# EAGLE design LNA_TL_choke (EAGLE 6.5.0)
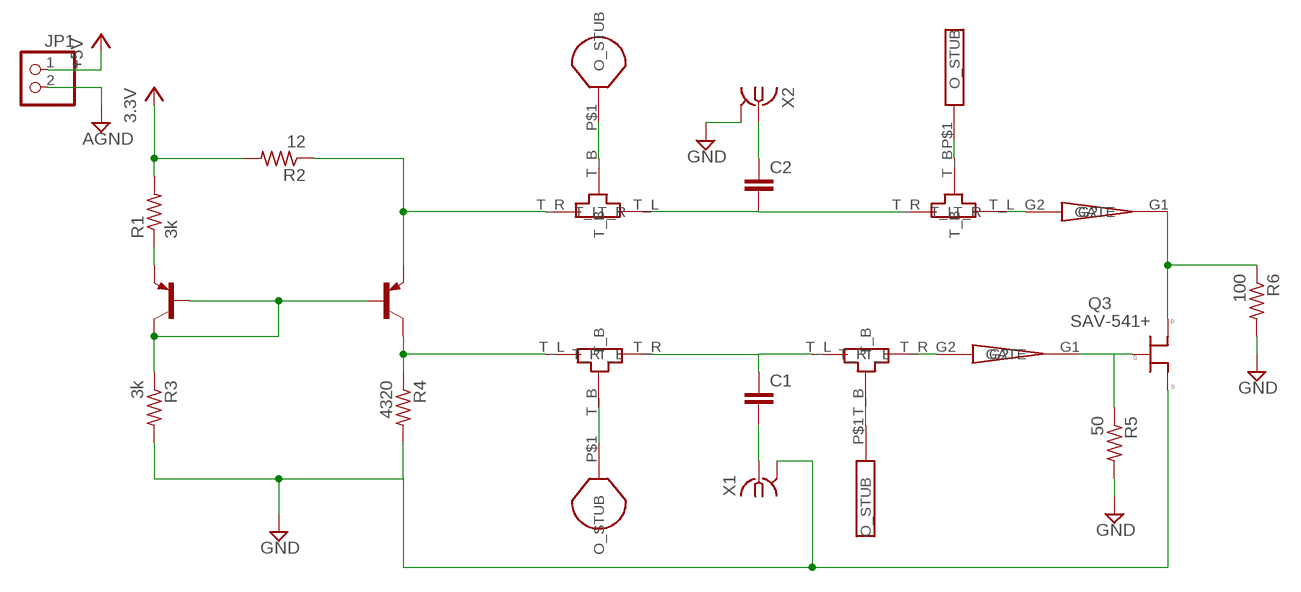
[diagram p0: schematic, sheet 1]

## Parts
C1  C-EUC0603  [C0603]
C2  C-EUC0603  [C0603]
JP1  PINHD-1X2  [1X02]
Q1  MMBT3906LT1SMD  [SOT23-BEC]
Q2  MMBT3906LT1SMD  [SOT23-BEC]
Q3  SAV-541+  [SOT-343]
R1  3k  R-US_M1206  [M1206]
R2  12  R-US_M1206  [M1206]
R3  3k  R-US_M1206  [M1206]
R4  4320  R-US_M1206  [M1206]
R5  50  R-US_M1206  [M1206]
R6  100  R-US_M1206  [M1206]
U$1  TAPPERED_TL1  [TAPPERED_TL1]
U$2  TEE_TL1  [TEE_TL1]
U$3  OPEN_STUB1  [OPEN_STUB1]
U$4  TAPPERED_TL1  [TAPPERED_TL1]
U$5  TEE_TL1  [TEE_TL1]
U$6  OPEN_STUB1  [OPEN_STUB1]
U$7  TEE_05MM  [TEE_05MM]
U$8  RADIAL_STUB  [RADIAL_STUB]
U$9  TEE_05MM  [TEE_05MM]
U$10  RADIAL_STUB  [RADIAL_STUB]
X1  SMA-142-0701-871/876  [J502-ND-142-0701-871/876]
X2  SMA-142-0701-871/876  [J502-ND-142-0701-871/876]

## Nets
+3.3V: JP1.1 R1.2 R2.2 ; supply symbol labelled +5V, 3.3V
GND: JP1.2 Q3.2(S) Q3.4(S) R3.2 R4.2 R5.2 R6.2 X1.G@1 X1.G@2 X1.G@3 X1.G@4 X2.G@1 X2.G@2 X2.G@3 X2.G@4 ; supply symbol labelled AGND
N$1: Q1.B Q1.C Q2.B R3.1
N$2: Q2.C R4.1 U$7.T_L
N$3: Q3.3(G) R5.1 U$1.G1(GATE)
N$4: Q1.E R1.1
N$5: U$1.G2 U$2.T_R
N$6: Q2.E R2.1 U$9.T_R
N$7: C1.1 U$2.T_L U$7.T_R
N$8: U$2.T_B U$3.P$1(O_STUB)
N$9: C1.2 X1.1
N$10: C2.2 U$5.T_R U$9.T_L
N$11: C2.1 X2.1
N$12: Q3.1(D) R6.1 U$4.G1(GATE)
N$14: U$5.T_B U$6.P$1(O_STUB)
N$15: U$4.G2 U$5.T_L
N$16: U$9.T_B U$10.P$1(O_STUB)
N$17: U$7.T_B U$8.P$1(O_STUB)

## Library data of the parts
C1 C2 = rcl:C-EU: CAPACITOR, European symbol
JP1 = pinhead:PINHD-1X2: PIN HEADER
Q1 Q2 = transistor-pnp:MMBT3906*: PNP Transistror
Q3 = ECE532_Parts:SAV-541+
R1-R6 = rcl:R-US_: RESISTOR, American symbol
U$1 U$4 = ECE532_Parts:TAPPERED_TL1
U$2 U$5 = ECE532_Parts:TEE_TL1
U$3 U$6 = ECE532_Parts:OPEN_STUB1
U$7 U$9 = ECE532_Parts:TEE_05MM
U$8 U$10 = ECE532_Parts:RADIAL_STUB
X1 X2 = con-coax:SMA-: SMA 50 Ohm End Launch Jack Receptacle - Round Contact Johnson Components Source: www.johnsoncomponents.com .. J502-ND.pdf; MF: JOHNSON COMPONENTS; MPN: 142-0701-871; OC_FARNELL: 1339835; OC_NEWARK: 91B6105

## Board
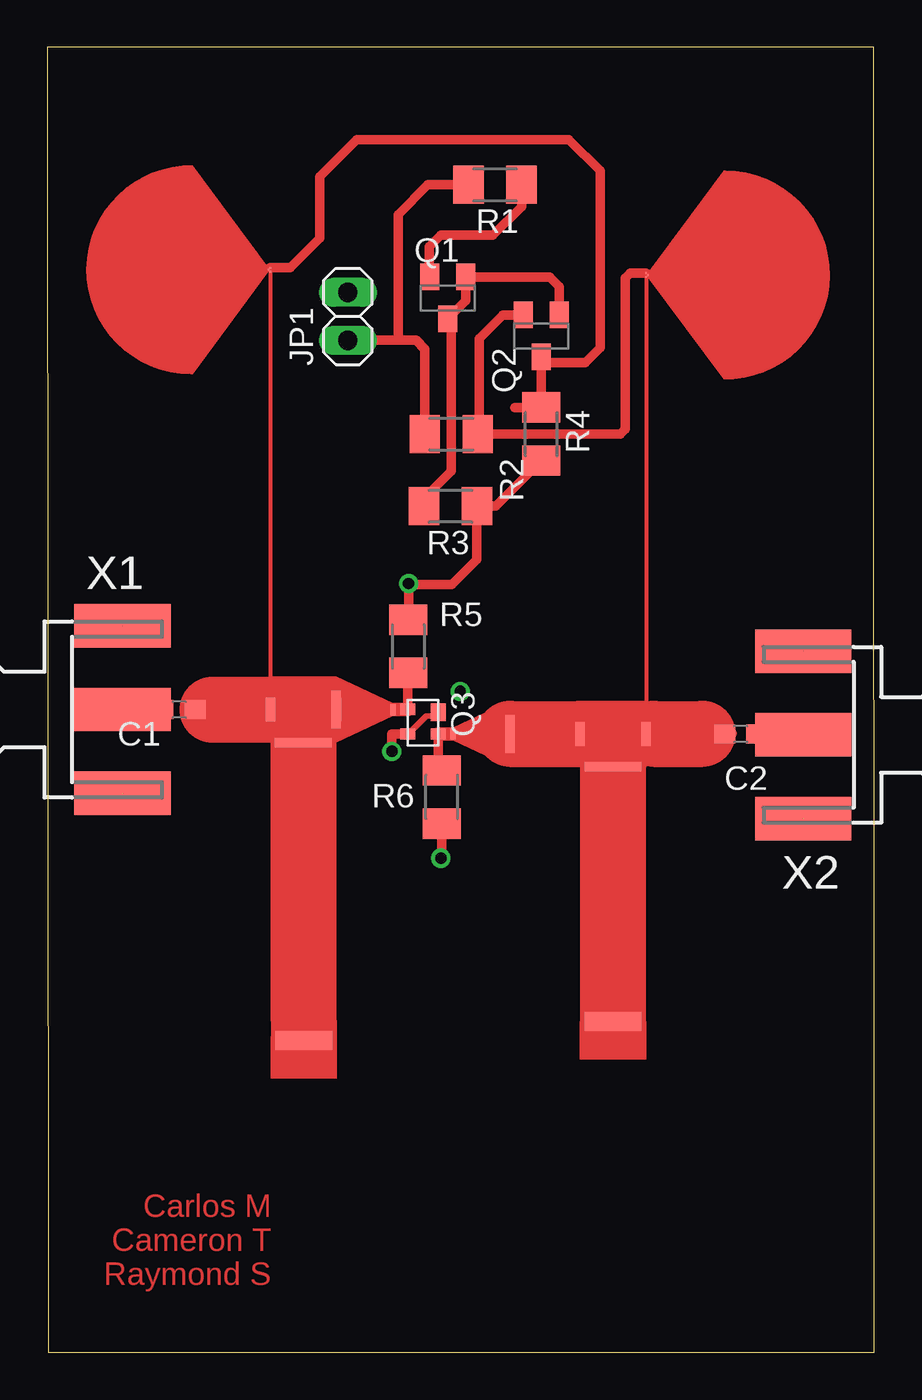
[diagram p1: board, top side]
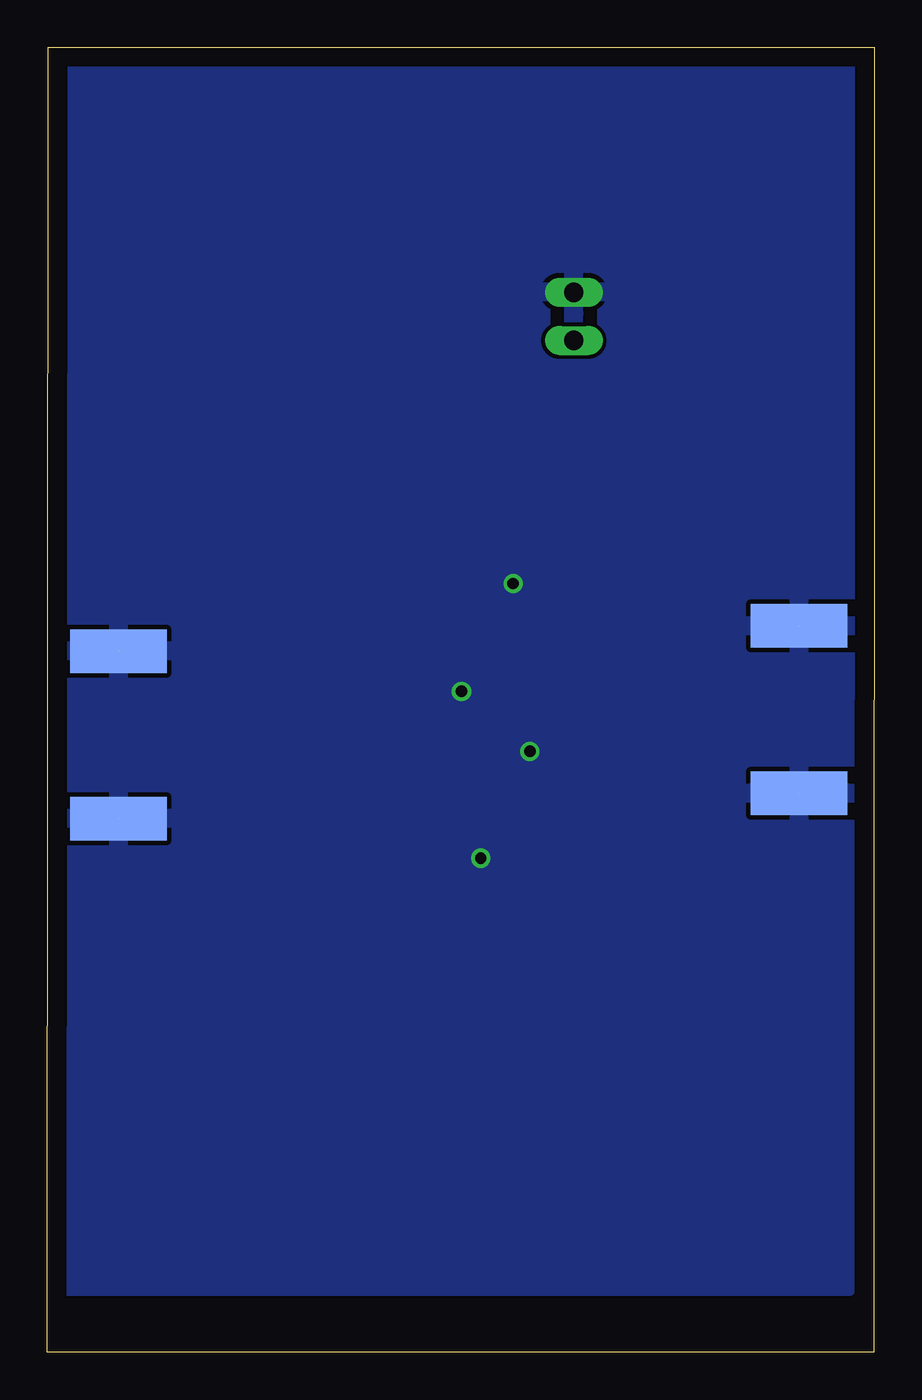
[diagram p2: board, bottom side, seen from below]

Size 43.64 x 68.88 mm. Coordinates in mm from the lower left corner, seen from the top.
Outline: 0.04,0 43.64,0 43.6,68.88 0,68.88 0.04,0
Copper layers (1*16): Top 0.035mm / dielectric 1.5mm / Bottom 0.035mm
Design rules "default": minimum track width 10mil, minimum drill 24mil, track to track 8mil, track to pad 8mil, pad to pad 8mil, via to via 8mil, smd to smd 8mil, copper to edge 40mil, drill to drill 8mil, minimum pad ring 10mil, minimum via ring 8mil, stop-mask expansion 4mil, vias tented up to drill 0mil, thermal gap 10mil

### Footprints (pad centres in the part's own frame; a part is rotated, then mirrored left to right if it is on the bottom)
C0603 = smd 1.1 x 1: 1 -0.85,0; 2 0.85,0
1X02 = drill 1.016 long: 1 -1.27,0; 2 1.27,0
SOT23-BEC = smd 1 x 1.4: B -0.95,-1.1; C 0,1.1; E 0.95,-1.1
SOT-343 = smd 0.6 x 0.8: 1 1.3,1.6; 3 0,0; 4 1.3,0 | smd 0.9 x 0.8: 2 0.15,1.6
M1206 = smd 1.6 x 2: 1 -1.4,0; 2 1.4,0
TAPPERED_TL1 = smd 0.6 x 0.3: G1 0,-3.08 | smd 2 x 0.5: G2 0,-0.08
TEE_TL1 = smd 3 x 0.5: T_B 0,-0.475 | smd 0.5 x 1.27: T_L -1.745,1.27; T_R 1.745,1.27
OPEN_STUB1 = smd 3 x 1: P$1 0,0
TEE_05MM = smd 0.09 x 0.09: T_B 0,-0.102; T_L -0.102,0; T_R 0.102,0
RADIAL_STUB = smd 0.09 x 0.09: P$1 0,0
J502-ND-142-0701-871/876 = smd 5.08 x 2.286: 1 2.565,0; G@1 2.565,4.42; G@2 2.565,-4.42 | smd 5.08 x 2.286 bottom: G@3 2.565,4.42; G@4 2.565,-4.42

### Placement (x,y rotation side)
C1  6.96,33.92 180 top
C2  36.59,32.64 180 top
JP1  15.86,54.68 90 top
Q1  21.12,55.65 180 top
Q2  26.06,53.65 180 top
Q3  19.02,33.93 270 top
R1  23.62,61.63 180 top
R2  21.31,48.47 180 top
R3  21.27,44.66 0 top
R4  26.06,48.47 270 top
R5  19.05,37.26 90 top
R6  20.82,29.3 270 top
U$1  15.16,33.92 90 top
U$2  13.51,32.66 0 top
U$3  13.53,16.46 0 top
U$4  24.49,32.64 270 top
U$5  29.85,31.37 0 top
U$6  29.85,17.47 0 top
U$7  11.77,57.14 270 top
U$8  11.67,57.14 90 top
U$9  31.59,56.86 90 top
U$10  31.69,56.86 270 top
X1  1.41,33.92 0 top
X2  42.45,32.59 180 top

### Tracks (layer width: path | path; a pad name or v marks a point on that pad's centre or on a via)
+3.3V
  Top 0.5: R2.2 19.91,52.96 19.46,53.41 18.74,53.41 | 18.74,53.41 JP1.1 | R1.2 20.09,61.63 18.51,60.05 18.51,53.64 18.74,53.41
GND  (via drill 0.6)  (4 unrouted)
  Top 0.3: Q3.4 19.04,32.63 20.01,33.59 20.43,33.59 Q3.2
  Top 0.5: R5.2 19.06,38.66 v19.06,40.58 19.13,40.51 21.34,40.51 22.67,41.85 R3.2 23.65,44.66 R4.2 | Q3.4 18.18,32.63 v18.18,31.71 | v20.77,26.08 20.82,26.08 R6.2
  other vias: 21.79,34.88
  pour Bottom: 58.81,3.44 58.81,88.4 1.41,89.8 1.41,3.44
N$1
  Top 0.5: R3.1 19.87,45.07 21.31,46.51 21.31,54.37 Q1.C 22.07,55.5 Q1.B 26.5,56.76 27.01,56.25 Q2.B
N$2
  Top 0.5: 24.66,49.87 R4.1 Q2.C 26.37,52.24 28.39,52.24 29.17,53.02 29.17,62.37 27.53,64.02 16.34,64.02 14.37,62.05 14.37,58.81 12.81,57.25 U$7.T_L
N$3
  Top 0.5: Q3.3 19.02,36.03 R5.1
  Top 0.7: U$1.G1 19.01,33.92 Q3.3
N$4
  Top 0.5: R1.1 25.03,60.48 23.5,58.96 20.75,58.96 20.16,58.36 20.16,56.77 Q1.E
N$5
  Top 1: U$1.G2 U$2.T_R
N$6
  Top 0.5: Q2.E 24.04,54.75 22.79,53.5 22.79,48.55 R2.1 30.24,48.46 30.5,48.73 30.5,56.7 30.76,56.96 U$9.T_R
N$7
  Top 0.203: U$7.T_R U$2.T_L
  Top 1: C1.1 8.71,33.92 | U$2.T_L 11.85,33.92
  Top 3.49: 8.71,33.92 11.7,33.92 U$2.T_L
N$8
  Top 3.49: U$2.T_B 13.51,18.55 U$3.P$1
N$9
  Top 0.406: X1.1 C1.2
N$10
  Top 0.203: U$9.T_L U$5.T_R
  Top 0.5: 30.33,32.64 U$5.T_R 31.99,32.64 | 34.58,32.65 36.14,32.65 C2.2
  Top 3.49: 31.99,32.64 34.58,32.64 34.58,32.65
N$11
  Top 0.5: C2.1 40.29,32.64 X2.1
N$12
  Top 0.5: Q3.1 20.62,30.8 R6.1
  Top 0.7: U$4.G1 Q3.1
N$13
  pour Top: 8.78,34.61 8.86,34.61 8.86,34.94
N$14
  Top 3.49: U$5.T_B U$6.P$1
N$15
  Top 3.49: U$4.G2 28.5,32.64 U$5.T_L
N$16
  Top 0.203: U$9.T_B
N$17
  Top 0.203: U$8.P$1

### Text on the board
Top: Carlos M / Cameron T / Raymond S